# EAGLE design CamLanternBRD (EAGLE 9.0.0)
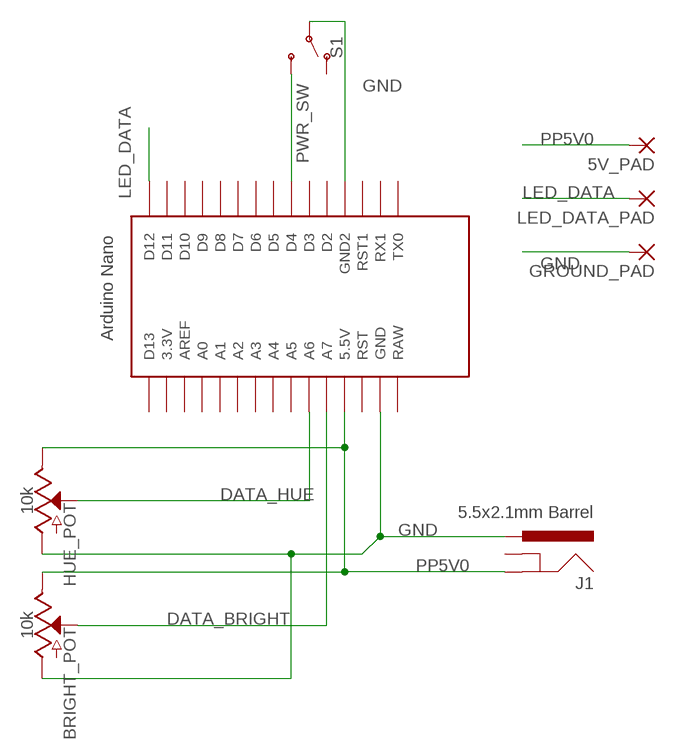
[diagram p0: schematic, sheet 1]

## Parts
5V_PAD  1,6/0,9  [1,6/0,9]
BRIGHT_POT  10k  POTENTIOMETER-PTH-9MM-1/20W-20%-KIT  [POT-PTH-ALPS-KIT]
GROUND_PAD  1,6/0,9  [1,6/0,9]
HUE_POT  10k  POTENTIOMETER-PTH-9MM-1/20W-20%-KIT  [POT-PTH-ALPS-KIT]
J1  5.5x2.1mm Barrel  POWER_JACKSMD  [POWER_JACK_SMD]
LED_DATA_PAD  1,6/0,9  [1,6/0,9]
S1  SWITCH-SPDT-PTH-11.6X4.0MM  [SWITCH_SPDT_PTH_11.6X4.0MM]
U$2  NANO  [NANO]

## Nets
DATA_BRIGHT: BRIGHT_POT.P$2(S) U$2.A7
DATA_HUE: HUE_POT.P$2(S) U$2.A6
GND: BRIGHT_POT.P$3(A) GROUND_PAD.1(P) HUE_POT.P$3(A) J1.VIN0(PWR) S1.2(P) U$2.GND U$2.GND1(GND2)
LED_DATA: LED_DATA_PAD.1(P) U$2.D12
PP5V0: 5V_PAD.1(P) BRIGHT_POT.P$1(E) HUE_POT.P$1(E) J1.P$4(GND) U$2.5V(5.5V)
PWR_SW: S1.3(S) U$2.D4
Unconnected: J1.GND(GNDBREAK) S1.1(O) U$2.3.3V U$2.A0 U$2.A1 U$2.A2 U$2.A3 U$2.A4 U$2.A5 U$2.AREF U$2.D2 U$2.D3 U$2.D5 U$2.D6 U$2.D7 U$2.D8 U$2.D9 U$2.D10 U$2.D11 U$2.D13 U$2.ICSP1 U$2.ICSP2 U$2.ICSP3 U$2.ICSP4 U$2.ICSP5 U$2.ICSP6 U$2.RAW U$2.RST U$2.RST1 U$2.RX1 U$2.TX0

## Library data of the parts
5V_PAD GROUND_PAD LED_DATA_PAD = wirepad:1,6/0,9: THROUGH-HOLE PAD
BRIGHT_POT HUE_POT = SparkFun-Resistors:POTENTIOMETER: Potentiometer (Pot) Three-terminal potentiometers, with an adjustable wiper and two adjustable resistors. A pot can be used to create a configurable voltage divider, or as a variable resistor. Variants ALPS_POT and ALPS_POT_KIT - PTH, breadboard compatible, 9mm square pots Rotary Potentiometer - Linear (10k ohm) <https://www.sparkfun.com/products/9288> (COM-09288) The KIT variant exposes copper on only one side of the PTH pad, so the part can only be assembled on one side of the PCB. Useful for beginner soldering kits.; PROD_ID: RES-09177; SF_SKU: COM-09288
J1 = SparkFun-Connectors:POWER_JACK: Power Jack Connector This is the standard 5.5mm barrel jack for power. The PTH is the most common, proven, reliable, footprint. The Slot footprint only works if the mill layer is transmitted to the PCB fab house so be warned. Here are the connectors we sell at SparkFun: DC Barrel Power Jack/Connector <https://www.sparkfun.com/products/119> (PRT-00119) DC Barrel Power Jack/Connector (SMD) <https://www.sparkfun.com/products/12748> (PRT-12748) DC Barrel Jack Adapter - Breadboard Compatible <https://www.sparkfun.com/products/10811> (PRT-10811) It is used on this SparkFun product (and many, many others): SparkFun RedBoard - Programmed with Arduino <https://www.sparkfun.com/products/12757> (DEV-12757) Also, if you need a mating power supply or connector, please check these out: Wall Adapter Power Supply - 9VDC 650mA <https://www.sparkfun.com/products/298> (TOL-00298) DC Barrel Jack Adapter - Male <https://www.sparkfun.com/products/10287> (PRT-10287); PROD_ID: CONN-08106; SF_ID: PRT-12748
S1 = SparkFun-Switches:SWITCH-SPDT: Single Pole, Double Throw (SPDT) Switch Single-pole, double-throw (SPDT) switch. Variant Overview SMD-AYZ0202 Surface Mount DPDT Switch <https://www.sparkfun.com/products/597> (COM-00597) Used on e.g. LilyPad Arduino USB - ATmega32U4 Board <https://www.sparkfun.com/products/12049> PTH-11.6X4.0MM SPDT Mini Power Switch <https://www.sparkfun.com/products/102> (COM-00102) Used on e.g. SparkFun Simon Says - Through-Hole Soldering Kit <https://www.sparkfun.com/products/10547> (KIT-10547) PTH-11.6X4.0MM-KIT KIT version of SPDT Mini Power Switch - Simplifies soldering by removing tStop of switch pins - only one side can be soldered. PTH-11.6X4.0MM-LOCK LOCK version of SPDT Mini Power Switch - Offset pins hold switch in place for easier soldering. SMD-RIGHT-ANGLE Surface Mount Right Angle Switch <https://www.sparkfun.com/products/10860> (COM-10860) Used on e.g. SparkFun ESP8266 Thing <https://www.sparkfun.com/products/13231>; PROD_ID: SWCH-08261; SF_SKU: COM-00102
U$2 = Arduino-clone:NANO: Arduino Nano

## Board
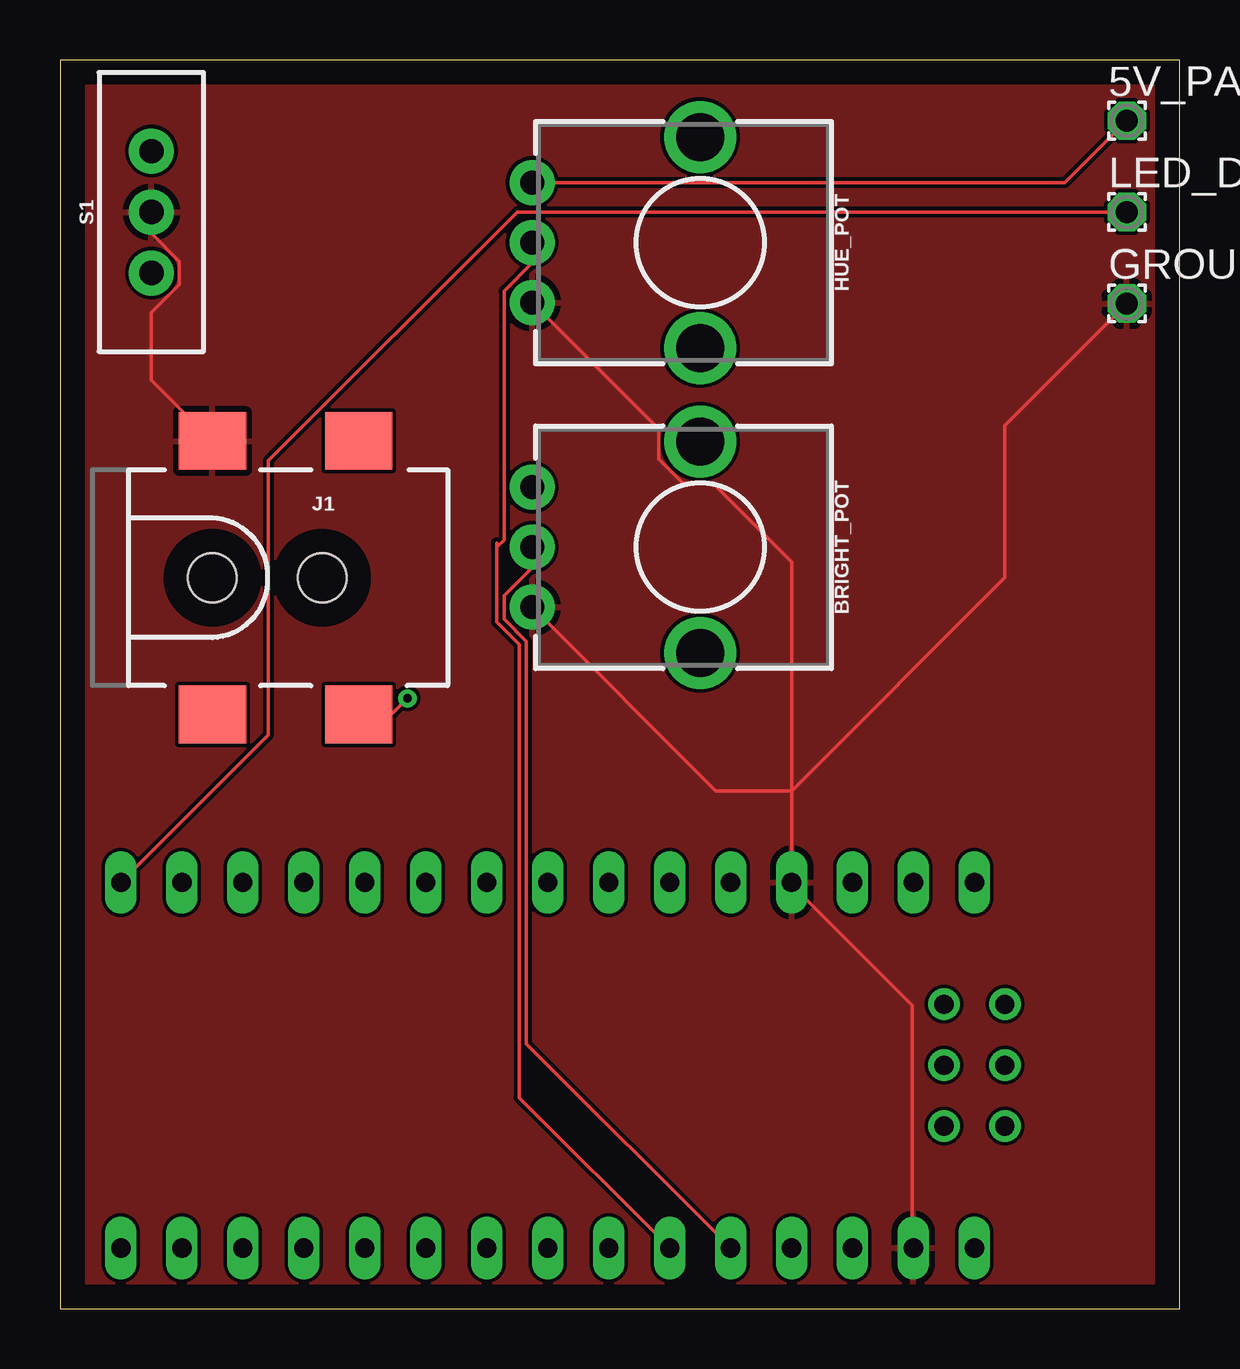
[diagram p1: board, top side]
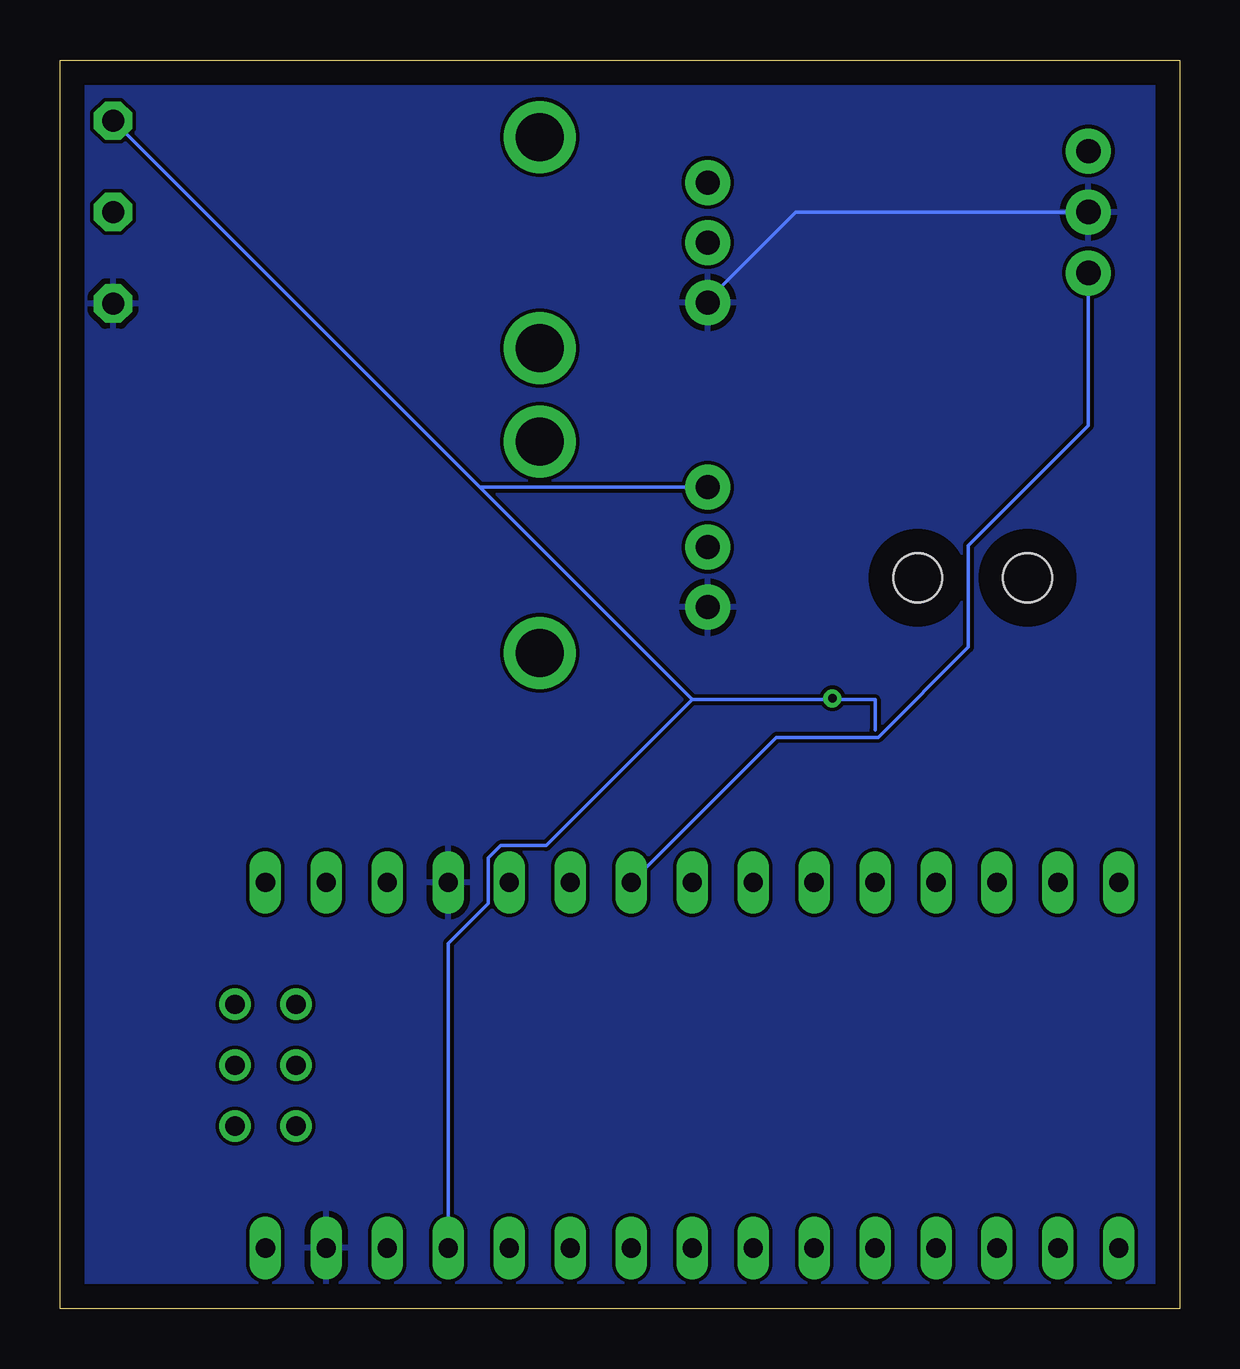
[diagram p2: board, bottom side, seen from below]

Size 46.66 x 52.06 mm. Coordinates in mm from the lower left corner, seen from the top.
Outline: 0,0 46.66,0 46.66,52.06 0,52.06 0,0
Copper layers (1*16): Top 0.035mm / dielectric 1.5mm / Bottom 0.035mm
Design rules "default": minimum track width 6mil, minimum drill 0.35mm, track to track 6mil, track to pad 6mil, pad to pad 6mil, via to via 6mil, smd to smd 6mil, copper to edge 40mil, drill to drill 6mil, minimum pad ring 10mil, minimum via ring 8mil, stop-mask expansion 4mil, vias tented up to drill 0mil, thermal gap 10mil

### Footprints (pad centres in the part's own frame; a part is rotated, then mirrored left to right if it is on the bottom)
1,6/0,9 = drill 0.914 pad 1.6 octagon: 1 0,0
POT-PTH-ALPS-KIT = drill 1 pad 1.88: P$1 7,-2.5; P$2 7,0; P$3 7,2.5 | drill 2: P$4 0,-4.4; P$5 0,4.4
POWER_JACK_SMD = smd 2.8 x 2.4: GND 0,-5.7; P$4 6.1,-5.7; VIN0 0,5.7; VIN1 6.1,5.7 | hole 2.032: 0,0; 4.572,0
SWITCH_SPDT_PTH_11.6X4.0MM = drill 1.016 pad 1.88: 1 0,2.54; 2 0,0; 3 0,-2.54
NANO = drill 0.8 long: 3.3V -10.16,24.13; 5V -10.16,-1.27; A0 -10.16,19.05; A1 -10.16,16.51; A2 -10.16,13.97; A3 -10.16,11.43; A4 -10.16,8.89; A5 -10.16,6.35; A6 -10.16,3.81; A7 -10.16,1.27; AREF -10.16,21.59; D2 5.08,1.27; D3 5.08,3.81; D4 5.08,6.35; D5 5.08,8.89; D6 5.08,11.43; D7 5.08,13.97; D8 5.08,16.51; D9 5.08,19.05; D10 5.08,21.59; D11 5.08,24.13; D12 5.08,26.67; D13 -10.16,26.67; GND -10.16,-6.35; GND1 5.08,-1.27; RAW -10.16,-8.89; RST -10.16,-3.81; RST1 5.08,-3.81; RX1 5.08,-6.35; TX0 5.08,-8.89 | drill 0.8: ICSP1 -5.08,-10.16; ICSP2 -5.08,-7.62; ICSP3 -2.54,-10.16; ICSP4 -2.54,-7.62; ICSP5 0,-10.16; ICSP6 0,-7.62

### Placement (x,y rotation side)
5V_PAD  44.45,49.53 0 top
BRIGHT_POT  26.67,31.75 180 top
GROUND_PAD  44.45,41.91 0 top
HUE_POT  26.67,44.45 180 top
J1  6.35,30.48 0 top
LED_DATA_PAD  44.45,45.72 0 top
S1  3.81,45.72 0 top
U$2  29.21,12.7 90 top

### Tracks (layer width: path | path; a pad name or v marks a point on that pad's centre or on a via)
DATA_BRIGHT
  Top 0.152: BRIGHT_POT.P$2 19.67,30.9 18.5,29.73 18.5,28.77 19.44,27.83 19.44,11.04 U$2.A7
DATA_HUE
  Top 0.152: HUE_POT.P$2 19.67,43.6 18.5,42.43 18.5,32.05 18.2,31.75 | 18.2,31.93 18.2,31.75 | 18.2,31.75 18.2,28.64 19.13,27.7 19.13,8.81 U$2.A6
GND
  Top 0.152: GROUND_PAD.1 39.37,36.83 39.37,30.48 30.48,21.59 | 30.48,21.59 30.48,31.14 27.2,34.42 25.95,34.42 24.94,35.43 24.94,36.68 HUE_POT.P$3 | 30.48,21.59 U$2.GND1 30.48,17.68 35.51,12.65 35.51,2.59 U$2.GND | BRIGHT_POT.P$3 27.33,21.59 30.48,21.59 | J1.VIN0 3.81,38.72 3.81,41.53 4.98,42.7 4.98,43.66 3.81,44.83 S1.2
  Bottom 0.152: S1.2 16,45.72 19.66,42.06 HUE_POT.P$3
  pour Top: 0,52.07 46.99,52.07 46.99,0 0,0
  pour Bottom: 0,52.07 46.99,52.07 46.99,0 0,0
LED_DATA
  Top 0.152: U$2.D12 8.69,23.93 8.69,35.36 19.05,45.72 LED_DATA_PAD.1
PP5V0  (via drill 0.35)
  Top 0.152: 5V_PAD.1 41.87,46.95 HUE_POT.P$1 | v14.48,25.45 13.87,24.84 12.5,24.84 J1.P$4
  Bottom 0.152: BRIGHT_POT.P$1 29.17,34.25 5V_PAD.1 20.32,25.4 | 12.7,24.13 12.7,25.4 14.48,25.4 | 20.32,25.4 14.48,25.4 | U$2.5V 30.48,15.24 28.82,16.9 28.82,18.8 28.31,19.32 26.4,19.32 20.32,25.4 | v14.48,25.45 14.48,25.4
PWR_SW
  Bottom 0.152: S1.3 3.81,36.83 8.81,31.83 8.81,27.59 12.57,23.83 16.82,23.83 U$2.D4